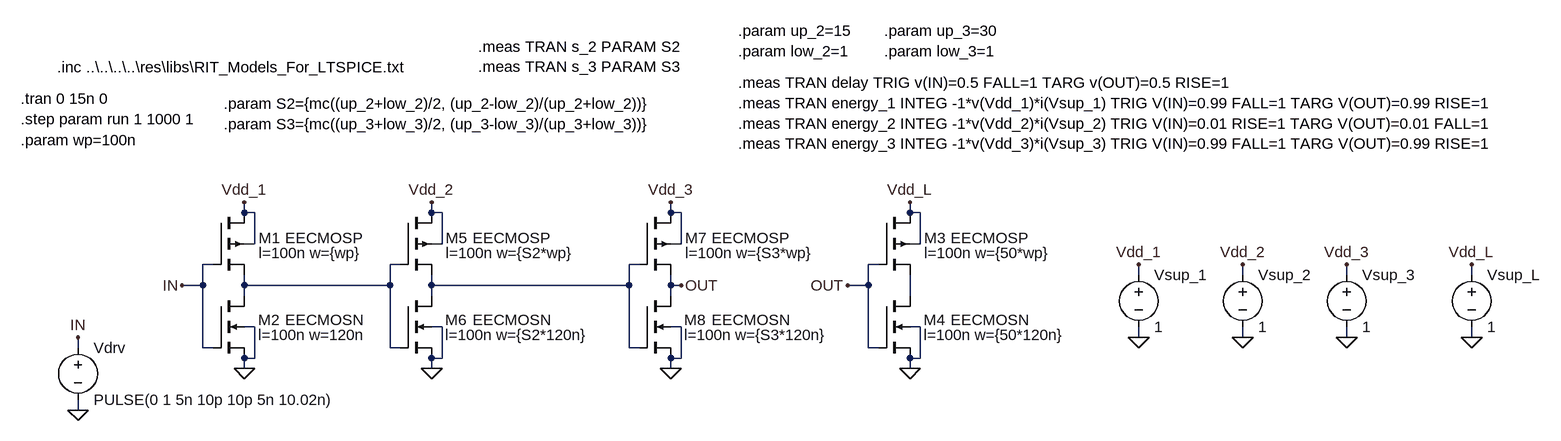
[diagram p0: schematic buffer_montecarlo.asc]
buffer_montecarlo.asc, the LTspice schematic file:
Version 4
SHEET 1 3232 680
WIRE 336 16 336 0
WIRE 352 16 336 16
WIRE 624 16 624 0
WIRE 640 16 624 16
WIRE 992 16 992 0
WIRE 1008 16 992 16
WIRE 1360 16 1360 0
WIRE 1376 16 1360 16
WIRE 352 64 352 16
WIRE 352 64 336 64
WIRE 640 64 640 16
WIRE 640 64 624 64
WIRE 1008 64 1008 16
WIRE 1008 64 992 64
WIRE 1376 64 1376 16
WIRE 1376 64 1360 64
WIRE 288 96 272 96
WIRE 576 96 560 96
WIRE 944 96 928 96
WIRE 1312 96 1296 96
WIRE 1712 112 1712 96
WIRE 1872 112 1872 96
WIRE 2032 112 2032 96
WIRE 2224 112 2224 96
WIRE 272 128 272 96
WIRE 272 128 240 128
WIRE 336 128 336 112
WIRE 560 128 560 96
WIRE 560 128 336 128
WIRE 624 128 624 112
WIRE 928 128 928 96
WIRE 928 128 624 128
WIRE 992 128 992 112
WIRE 1008 128 992 128
WIRE 1296 128 1296 96
WIRE 1296 128 1264 128
WIRE 336 144 336 128
WIRE 624 144 624 128
WIRE 992 144 992 128
WIRE 1360 144 1360 112
WIRE 352 192 336 192
WIRE 640 192 624 192
WIRE 1008 192 992 192
WIRE 1376 192 1360 192
WIRE 1712 208 1712 192
WIRE 1872 208 1872 192
WIRE 2032 208 2032 192
WIRE 2224 208 2224 192
WIRE 80 224 80 208
WIRE 272 224 272 128
WIRE 288 224 272 224
WIRE 560 224 560 128
WIRE 576 224 560 224
WIRE 928 224 928 128
WIRE 944 224 928 224
WIRE 1296 224 1296 128
WIRE 1312 224 1296 224
WIRE 352 240 352 192
WIRE 352 240 336 240
WIRE 640 240 640 192
WIRE 640 240 624 240
WIRE 1008 240 1008 192
WIRE 1008 240 992 240
WIRE 1376 240 1376 192
WIRE 1376 240 1360 240
WIRE 336 256 336 240
WIRE 624 256 624 240
WIRE 992 256 992 240
WIRE 1360 256 1360 240
WIRE 80 320 80 304
FLAG 336 256 0
FLAG 336 0 Vdd_1
FLAG 240 128 IN
FLAG 80 208 IN
FLAG 2032 96 Vdd_3
FLAG 80 320 0
FLAG 2032 208 0
FLAG 1360 256 0
FLAG 1360 0 Vdd_L
FLAG 1264 128 OUT
FLAG 2224 96 Vdd_L
FLAG 2224 208 0
FLAG 624 256 0
FLAG 624 0 Vdd_2
FLAG 992 256 0
FLAG 992 0 Vdd_3
FLAG 1008 128 OUT
FLAG 1872 96 Vdd_2
FLAG 1872 208 0
FLAG 1712 96 Vdd_1
FLAG 1712 208 0
SYMBOL voltage 2032 96 R0
WINDOW 123 0 0 Left 0
WINDOW 39 0 0 Left 0
SYMATTR InstName Vsup_3
SYMATTR Value 1
SYMBOL voltage 80 208 R0
WINDOW 123 0 0 Left 0
WINDOW 39 0 0 Left 0
SYMATTR InstName Vdrv
SYMATTR Value PULSE(0 1 5n 10p 10p 5n 10.02n)
SYMBOL pmos4 288 16 R0
WINDOW 0 70 39 Left 2
WINDOW 3 111 39 Left 2
WINDOW 123 70 62 Left 2
SYMATTR InstName M1
SYMATTR Value EECMOSP
SYMATTR Value2 l=100n w={wp}
SYMBOL nmos4 288 144 R0
WINDOW 0 69 37 Left 2
WINDOW 3 111 37 Left 2
WINDOW 123 69 60 Left 2
SYMATTR InstName M2
SYMATTR Value EECMOSN
SYMATTR Value2 l=100n w=120n
SYMBOL pmos4 1312 16 R0
WINDOW 0 70 39 Left 2
WINDOW 3 111 39 Left 2
WINDOW 123 70 62 Left 2
SYMATTR InstName M3
SYMATTR Value EECMOSP
SYMATTR Value2 l=100n w={50*wp}
SYMBOL nmos4 1312 144 R0
WINDOW 0 69 37 Left 2
WINDOW 3 111 37 Left 2
WINDOW 123 69 60 Left 2
SYMATTR InstName M4
SYMATTR Value EECMOSN
SYMATTR Value2 l=100n w={50*120n}
SYMBOL voltage 2224 96 R0
WINDOW 123 0 0 Left 0
WINDOW 39 0 0 Left 0
SYMATTR InstName Vsup_L
SYMATTR Value 1
SYMBOL pmos4 576 16 R0
WINDOW 0 70 39 Left 2
WINDOW 3 111 39 Left 2
WINDOW 123 70 62 Left 2
SYMATTR InstName M5
SYMATTR Value EECMOSP
SYMATTR Value2 l=100n w={S2*wp}
SYMBOL nmos4 576 144 R0
WINDOW 0 69 37 Left 2
WINDOW 3 111 37 Left 2
WINDOW 123 69 60 Left 2
SYMATTR InstName M6
SYMATTR Value EECMOSN
SYMATTR Value2 l=100n w={S2*120n}
SYMBOL pmos4 944 16 R0
WINDOW 0 70 39 Left 2
WINDOW 3 111 39 Left 2
WINDOW 123 70 62 Left 2
SYMATTR InstName M7
SYMATTR Value EECMOSP
SYMATTR Value2 l=100n w={S3*wp}
SYMBOL nmos4 944 144 R0
WINDOW 0 69 37 Left 2
WINDOW 3 111 37 Left 2
WINDOW 123 69 60 Left 2
SYMATTR InstName M8
SYMATTR Value EECMOSN
SYMATTR Value2 l=100n w={S3*120n}
SYMBOL voltage 1872 96 R0
WINDOW 123 0 0 Left 0
WINDOW 39 0 0 Left 0
SYMATTR InstName Vsup_2
SYMATTR Value 1
SYMBOL voltage 1712 96 R0
WINDOW 123 0 0 Left 0
WINDOW 39 0 0 Left 0
SYMATTR InstName Vsup_1
SYMATTR Value 1
TEXT 48 -208 Left 2 !.inc ..\\..\\..\\..\\res\\libs\\RIT_Models_For_LTSPICE.txt
TEXT -8 -160 Left 2 !.tran 0 15n 0
TEXT -8 -128 Left 2 !.step param run 1 1000 1
TEXT -8 -96 Left 2 !.param wp=100n
TEXT 1096 -184 Left 2 !.meas TRAN delay TRIG v(IN)=0.5 FALL=1 TARG v(OUT)=0.5 RISE=1\n.meas TRAN energy_1 INTEG -1*v(Vdd_1)*i(Vsup_1) TRIG V(IN)=0.99 FALL=1 TARG V(OUT)=0.99 RISE=1\n.meas TRAN energy_2 INTEG -1*v(Vdd_2)*i(Vsup_2) TRIG V(IN)=0.01 RISE=1 TARG V(OUT)=0.01 FALL=1\n.meas TRAN energy_3 INTEG -1*v(Vdd_3)*i(Vsup_3) TRIG V(IN)=0.99 FALL=1 TARG V(OUT)=0.99 RISE=1
TEXT 304 -152 Left 2 !.param S2={mc((up_2+low_2)/2, (up_2-low_2)/(up_2+low_2))}\n.param S3={mc((up_3+low_3)/2, (up_3-low_3)/(up_3+low_3))}
TEXT 696 -240 Left 2 !.meas TRAN s_2 PARAM S2\n.meas TRAN s_3 PARAM S3
TEXT 1096 -264 Left 2 !.param up_2=15\n.param low_2=1
TEXT 1320 -264 Left 2 !.param up_3=30\n.param low_3=1

The netlist it stands for:
* buffer_montecarlo.asc
Vsup_3 Vdd_3 0 1
Vdrv IN 0 PULSE(0 1 5n 10p 10p 5n 10.02n)
M1 Vdd_1 IN N001 Vdd_1 EECMOSP l=100n w={wp}
M2 N001 IN 0 0 EECMOSN l=100n w=120n
M3 Vdd_L OUT N003 Vdd_L EECMOSP l=100n w={50*wp}
M4 N003 OUT 0 0 EECMOSN l=100n w={50*120n}
Vsup_L Vdd_L 0 1
M5 Vdd_2 N001 N002 Vdd_2 EECMOSP l=100n w={S2*wp}
M6 N002 N001 0 0 EECMOSN l=100n w={S2*120n}
M7 Vdd_3 N002 OUT Vdd_3 EECMOSP l=100n w={S3*wp}
M8 OUT N002 0 0 EECMOSN l=100n w={S3*120n}
Vsup_2 Vdd_2 0 1
Vsup_1 Vdd_1 0 1
.model NMOS NMOS
.model PMOS PMOS
.lib standard.mos
.inc ..\..\..\..\res\libs\RIT_Models_For_LTSPICE.txt
.tran 0 15n 0
.step param run 1 1000 1
.param wp=100n
.meas TRAN delay TRIG v(IN)=0.5 FALL=1 TARG v(OUT)=0.5 RISE=1
.meas TRAN energy_1 INTEG -1*v(Vdd_1)*i(Vsup_1) TRIG V(IN)=0.99 FALL=1 TARG V(OUT)=0.99 RISE=1
.meas TRAN energy_2 INTEG -1*v(Vdd_2)*i(Vsup_2) TRIG V(IN)=0.01 RISE=1 TARG V(OUT)=0.01 FALL=1
.meas TRAN energy_3 INTEG -1*v(Vdd_3)*i(Vsup_3) TRIG V(IN)=0.99 FALL=1 TARG V(OUT)=0.99 RISE=1
.param S2={mc((up_2+low_2)/2, (up_2-low_2)/(up_2+low_2))}
.param S3={mc((up_3+low_3)/2, (up_3-low_3)/(up_3+low_3))}
.meas TRAN s_2 PARAM S2
.meas TRAN s_3 PARAM S3
.param up_2=15
.param low_2=1
.param up_3=30
.param low_3=1
.backanno
.end